# Altium project ZS-004.PrjPcb
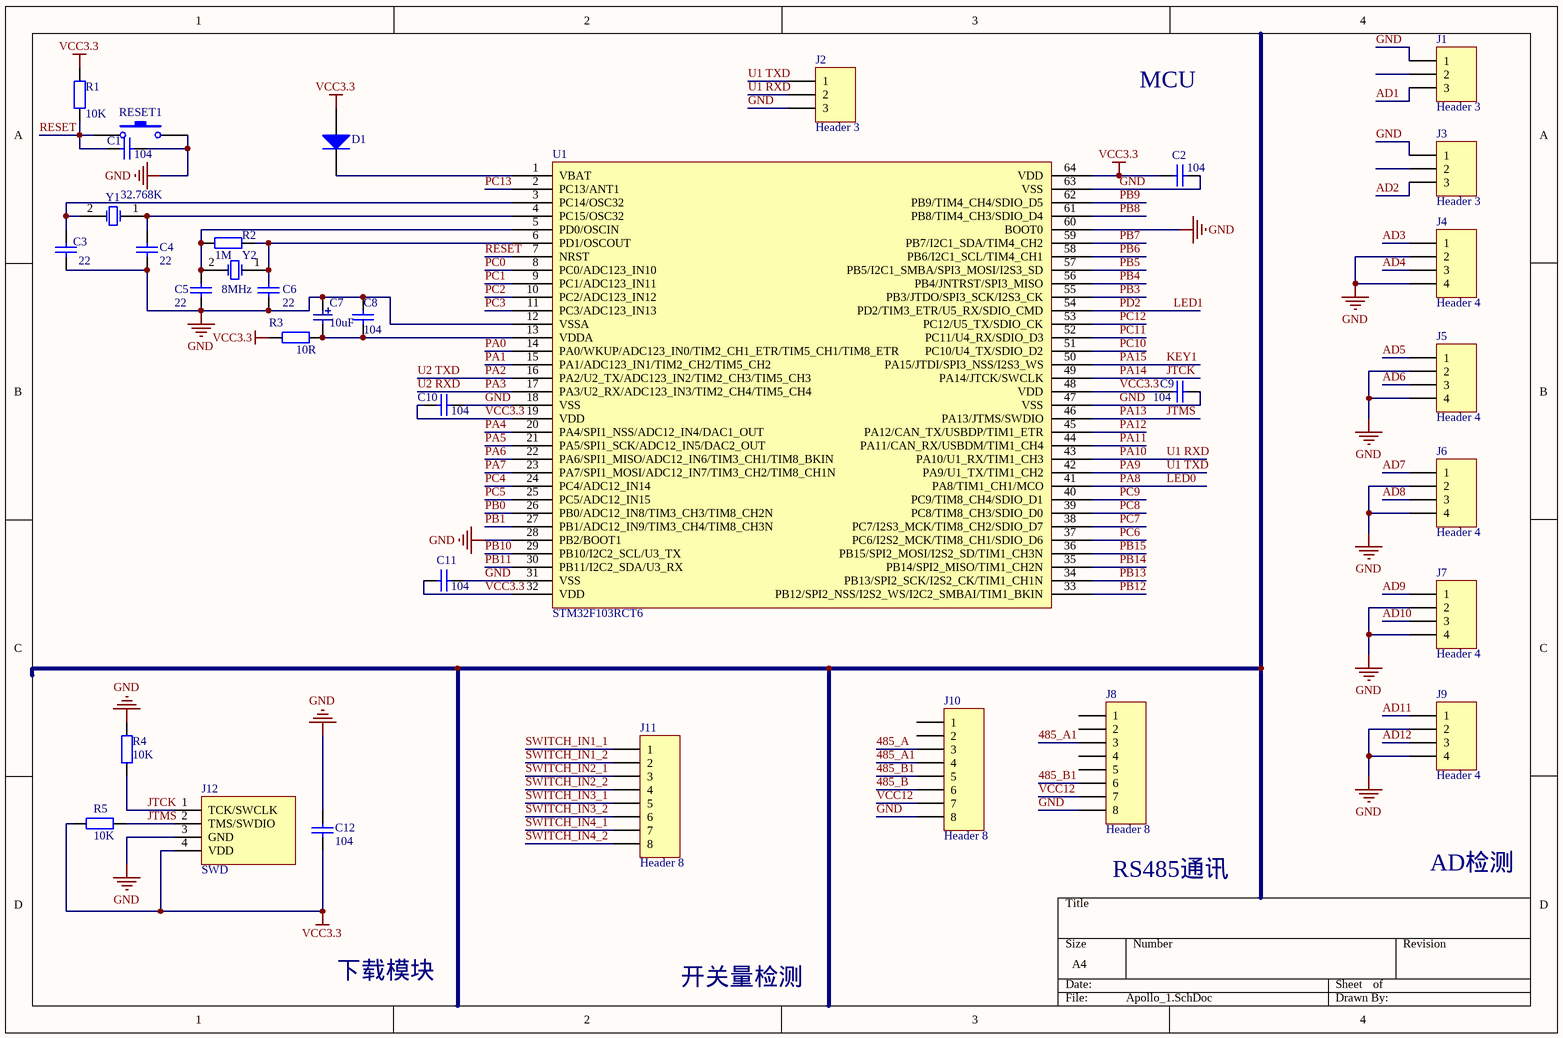
[diagram p0: Apollo_1.SchDoc]
3 sheets, 146 parts. Net scope: global (net labels, ports and power ports of the same name join across sheets).
Board file: Apollp.PcbDoc
Sheets:
  Apollo_1.SchDoc
  Apollo_2.SchDoc
  Apollo_3.SchDoc

## Sheet Apollo_1.SchDoc
size A4

### Parts
C1  value 104  [0805C]  (hidden comment: Cap)
C2  value 104  [0805C]  (hidden comment: Cap)
C3  value 22  [0805C]  (hidden comment: Cap)
C4  value 22  [0805C]  (hidden comment: Cap)
C5  value 22  [0805C]  (hidden comment: Cap)
C6  value 22  [0805C]  (hidden comment: Cap)
C7  10uF  [3216T]
C8  value 104  [0805c]  (hidden comment: Cap)
C9  value 104  [0805C]  (hidden comment: Cap)
C10  value 104  [0805C]  (hidden comment: Cap)
C11  value 104  [0805C]  (hidden comment: Cap)
C12  value 104  [0805C]  (hidden comment: Cap)
D1  Diode 1N914  [1206]  (value not drawn)
J1  Header 3  [HDR1X3]
J2  Header 3  [HDR1X3]
J3  Header 3  [HDR1X3]
J4  Header 4  [2EDG 4-3.80]
J5  Header 4  [2EDG 4-3.80]
J6  Header 4  [2EDG 4-3.80]
J7  Header 4  [2EDG 4-3.80]
J8  Header 8  [RJ45]
J9  Header 4  [2EDG 4-3.80]
J10  Header 8  [RJ45]
J11  Header 8  [2EDG 8-3.80]
J12  SWD  [SWD]
R1  value 10K  [0805]  (hidden comment: Res2)
R2  value 1M  [0805]  (hidden comment: Res2)
R3  value 10R  [0805]  (hidden comment: Res2)
R4  value 10K  [0805]  (hidden comment: Res2)
R5  value 10K  [0805]  (hidden comment: Res2)
RESET1  SW-PB  [SWITCH]  (value not drawn)
U1  STM32F103RCT6  [STM32F103RCT6]
Y1  XTAL  [tc-26]  (value not drawn)
Y2  8MHz  [Y2]

### Nets
GND: C1.2 C2.2 C3.1 C4.1 C5.1 C6.2 C7.1 C8.2 C9.2 C10.1 C11.2 C12.1 J1.1 J2.3 J3.1 J4.2 J4.4 J5.2 J5.4 J6.2 J6.4 J7.2 J7.4 J8.8 J9.2 J9.4 J10.8 J12.3(GND) R4.1 RESET1.2 U1.12(VSSA) U1.18(VSS) U1.28(PB2/BOOT1) U1.31(VSS) U1.47(VSS) U1.60(BOOT0) U1.63(VSS)
VCC3.3: C2.1 C9.1 C10.2 C11.1 C12.2 D1.1(A) J12.4(VDD) R1.2 R3.2 R5.2 U1.19(VDD) U1.32(VDD) U1.48(VDD) U1.64(VDD)
VCC12: J8.7 J10.7
32.768K: C3.2 U1.3(PC14/OSC32) Y1.2(OSC2)
485_A: J10.3
485_A1: J8.3 J10.4
485_B: J10.6
485_B1: J8.6 J10.5
AD1: J1.3
AD2: J3.3
AD3: J4.1
AD4: J4.3
AD5: J5.1
AD6: J5.3
AD7: J6.1
AD8: J6.3
AD9: J7.1
AD10: J7.3
AD11: J9.1
AD12: J9.3
JTCK: J12.1(TCK/SWCLK) R4.2 U1.49(PA14/JTCK/SWCLK)  [also labelled PA14]
JTMS: J12.2(TMS/SWDIO) R5.1 U1.46(PA13/JTMS/SWDIO)  [also labelled PA13]
KEY1: U1.50(PA15/JTDI/SPI3_NSS/I2S3_WS)  [also labelled PA15]
LED0: U1.41(PA8/TIM1_CH1/MCO)  [also labelled PA8]
LED1: U1.54(PD2/TIM3_ETR/U5_RX/SDIO_CMD)  [also labelled PD2]
PA0: U1.14(PA0/WKUP/ADC123_IN0/TIM2_CH1_ETR/TIM5_CH1/TIM8_ETR)
PA1: U1.15(PA1/ADC123_IN1/TIM2_CH2/TIM5_CH2)
PA2: U1.16(PA2/U2_TX/ADC123_IN2/TIM2_CH3/TIM5_CH3)  [also labelled U2 TXD]
PA3: U1.17(PA3/U2_RX/ADC123_IN3/TIM2_CH4/TIM5_CH4)  [also labelled U2 RXD]
PA4: U1.20(PA4/SPI1_NSS/ADC12_IN4/DAC1_OUT)
PA5: U1.21(PA5/SPI1_SCK/ADC12_IN5/DAC2_OUT)
PA6: U1.22(PA6/SPI1_MISO/ADC12_IN6/TIM3_CH1/TIM8_BKIN)
PA7: U1.23(PA7/SPI1_MOSI/ADC12_IN7/TIM3_CH2/TIM8_CH1N)
PA9: J2.1 U1.42(PA9/U1_TX/TIM1_CH2)  [also labelled U1 TXD]
PA10: J2.2 U1.43(PA10/U1_RX/TIM1_CH3)  [also labelled U1 RXD]
PA11: U1.44(PA11/CAN_RX/USBDM/TIM1_CH4)
PA12: U1.45(PA12/CAN_TX/USBDP/TIM1_ETR)
PB0: U1.26(PB0/ADC12_IN8/TIM3_CH3/TIM8_CH2N)
PB1: U1.27(PB1/ADC12_IN9/TIM3_CH4/TIM8_CH3N)
PB3: U1.55(PB3/JTDO/SPI3_SCK/I2S3_CK)
PB4: U1.56(PB4/JNTRST/SPI3_MISO)
PB5: U1.57(PB5/I2C1_SMBA/SPI3_MOSI/I2S3_SD)
PB6: U1.58(PB6/I2C1_SCL/TIM4_CH1)
PB7: U1.59(PB7/I2C1_SDA/TIM4_CH2)
PB8: U1.61(PB8/TIM4_CH3/SDIO_D4)
PB9: U1.62(PB9/TIM4_CH4/SDIO_D5)
PB10: U1.29(PB10/I2C2_SCL/U3_TX)
PB11: U1.30(PB11/I2C2_SDA/U3_RX)
PB12: U1.33(PB12/SPI2_NSS/I2S2_WS/I2C2_SMBAI/TIM1_BKIN)
PB13: U1.34(PB13/SPI2_SCK/I2S2_CK/TIM1_CH1N)
PB14: U1.35(PB14/SPI2_MISO/TIM1_CH2N)
PB15: U1.36(PB15/SPI2_MOSI/I2S2_SD/TIM1_CH3N)
PC0: U1.8(PC0/ADC123_IN10)
PC1: U1.9(PC1/ADC123_IN11)
PC2: U1.10(PC2/ADC123_IN12)
PC3: U1.11(PC3/ADC123_IN13)
PC4: U1.24(PC4/ADC12_IN14)
PC5: U1.25(PC5/ADC12_IN15)
PC6: U1.37(PC6/I2S2_MCK/TIM8_CH1/SDIO_D6)
PC7: U1.38(PC7/I2S3_MCK/TIM8_CH2/SDIO_D7)
PC8: U1.39(PC8/TIM8_CH3/SDIO_D0)
PC9: U1.40(PC9/TIM8_CH4/SDIO_D1)
PC10: U1.51(PC10/U4_TX/SDIO_D2)
PC11: U1.52(PC11/U4_RX/SDIO_D3)
PC12: U1.53(PC12/U5_TX/SDIO_CK)
PC13: U1.2(PC13/ANT1)
RESET: C1.1 R1.1 RESET1.1 U1.7(NRST)
SWITCH_IN1_1: J11.1
SWITCH_IN1_2: J11.2
SWITCH_IN2_1: J11.3
SWITCH_IN2_2: J11.4
SWITCH_IN3_1: J11.5
SWITCH_IN3_2: J11.6
SWITCH_IN4_1: J11.7
SWITCH_IN4_2: J11.8
NetC4_2: C4.2 U1.4(PC15/OSC32) Y1.1(OSC1)
NetC5_2: C5.2 R2.2 U1.5(PD0/OSCIN) Y2.2(OSC2)
NetC6_1: C6.1 R2.1 U1.6(PD1/OSCOUT) Y2.1(OSC1)
NetC7_2: C7.2 C8.1 R3.1 U1.13(VDDA)
NetD1_2: D1.2(K) U1.1(VBAT)

Not connected (* = marked no-connect by the designer): J1 2; J3 2; J8 1 2 4 5; J10 1 2

### Notes on the sheet
- Labels drawn without touching a wire or pin: AD检测, MCU, RS485通讯, 下载模块, 开关量检测

### Library data of the parts
C1-C6 C8-C12 = Cap: Capacitor; Published: 8-Jun-2000; LatestRevisionDate: 17-Jul-2002; LatestRevisionNote: Re-released for DXP Platform.; PackageReference: RAD-0.3; Publisher: Altium Limited; PackageDescription: Radial Cap, Thru-Hole; 2 Leads; 0.3 in Pin Spacing
C7 = CAP-POL1
D1 = Diode 1N914: High Conductance Fast Diode; Published: 8-Jun-2000; LatestRevisionDate: 17-Jul-2002; LatestRevisionNote: Re-released for DXP Platform.; DatasheetVersion: 1997; PackageReference: DO-35; Publisher: Altium Limited; PackageDescription: Diode, Axial; Body 3.8 x 1.9 mm (LxDia. max), Lead Dia. 0.53 mm (max); Code_JEDEC: DO-204-AH; ComponentLink1Description: Manufacturer Link; ComponentLink1URL: http://www.fairchildsemi.com/; ComponentLink2Description: Datasheet; ComponentLink2URL: http://www.fairchildsemi.com/ds/1N%2F1N4448.pdf
J1-J3 = Header 3: Header, 3-Pin; LatestRevisionDate: 17-Jul-2002; LatestRevisionNote: Re-released for DXP Platform.; Publisher: Altium Limited
J4-J7 J9 = Header 4: Header, 4-Pin; LatestRevisionDate: 17-Jul-2002; LatestRevisionNote: Re-released for DXP Platform.; Publisher: Altium Limited
J8 J10 J11 = Header 8: Header, 8-Pin; LatestRevisionDate: 17-Jul-2002; LatestRevisionNote: Re-released for DXP Platform.; Publisher: Altium Limited
R1-R5 = Res2: Resistor; Published: 8-Jun-2000; LatestRevisionDate: 17-Jul-2002; LatestRevisionNote: Re-released for DXP Platform.; PackageReference: AXIAL-0.4; Publisher: Altium Limited; PackageDescription: Axial Device, Thru-Hole; 2 Leads; 0.4 in Pin Spacing
RESET1 = SW-PB: Switch; Published: 24-Mar-1999; LatestRevisionDate: 17-Jul-2002; LatestRevisionNote: Re-released for DXP Platform.; PackageReference: SPST-2; Publisher: Altium Limited; PackageDescription: Switch; 2 Leads
Y1 Y2 = XTAL: Crystal Oscillator; Published: 8-Jun-2000; LatestRevisionDate: 17-Jul-2002; LatestRevisionNote: Re-released for DXP Platform.; PackageReference: R38; Publisher: Altium Limited; PackageDescription: Crystal, Thru-Hole; 2 Leads; Body 3.1 x 8.2 mm (Dia.xH)

## Sheet Apollo_2.SchDoc
size A4
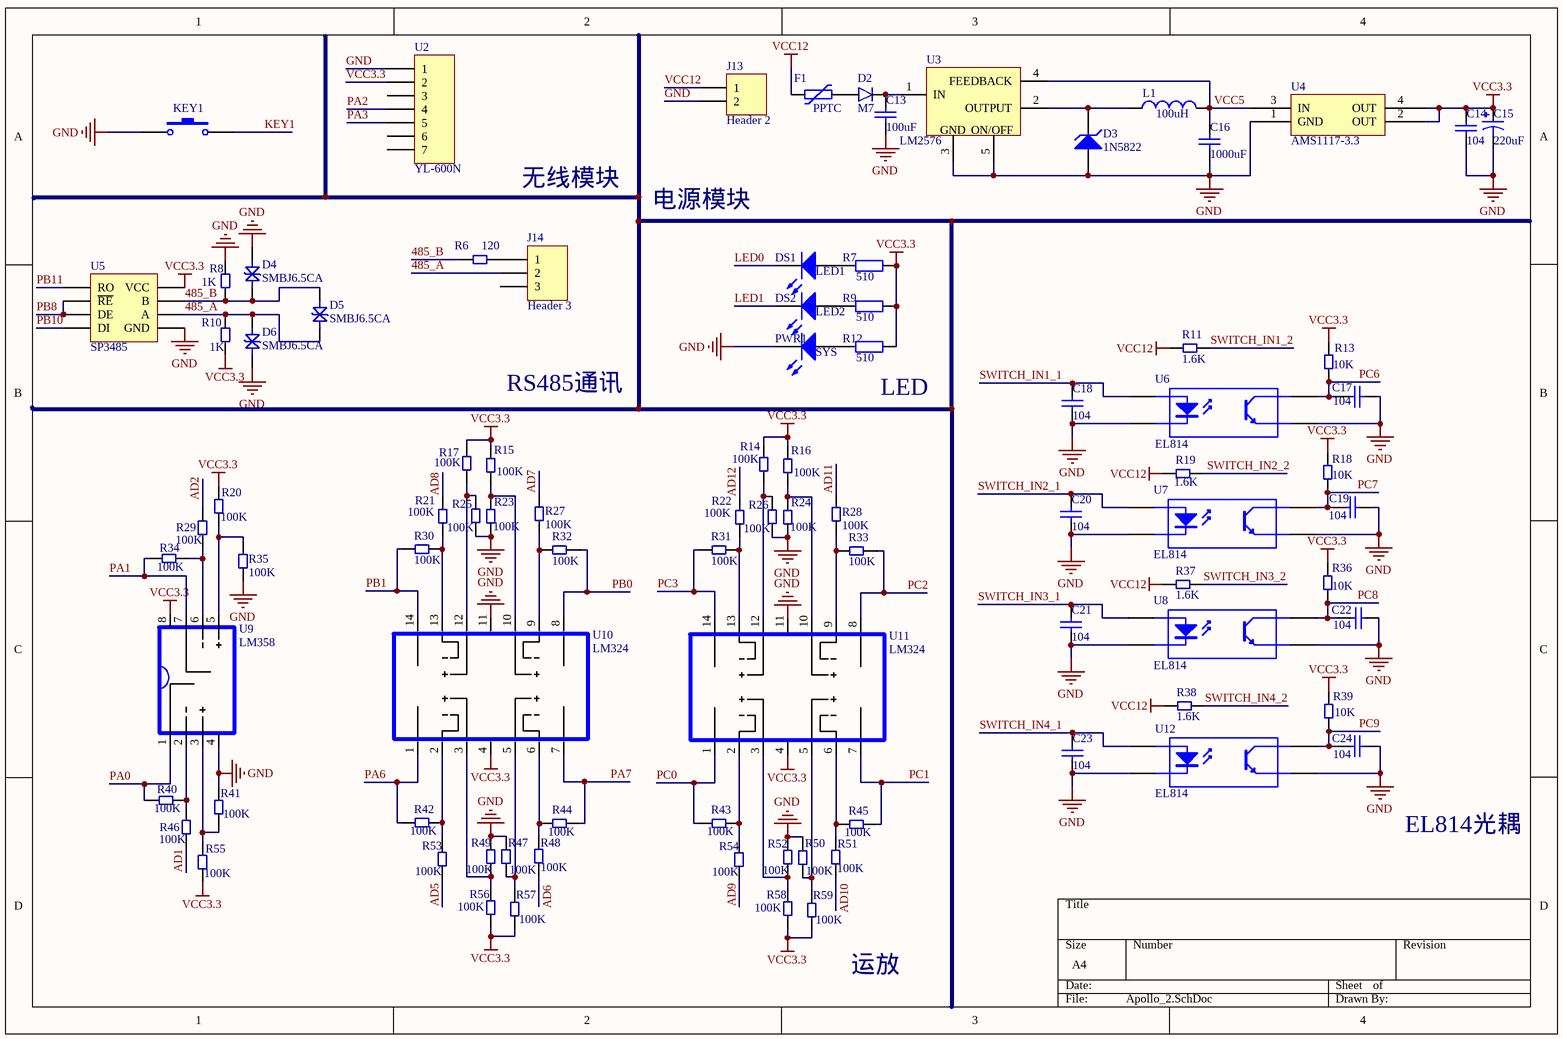
[diagram p1: Apollo_2.SchDoc]

### Parts
C13  value 100uF  [cap3.3-8 - duplicate]
C14  value 104  [0805]  (hidden comment: Cap)
C15  value 220uF  [C15]  (hidden comment: Cap Pol1)
C16  value 1000uF  [C16]
C17  value 104  [0805C]
C18  value 104  [0805C]
C19  value 104  [0805C]
C20  value 104  [0805C]
C21  value 104  [0805C]
C22  value 104  [0805C]
C23  value 104  [0805C]
C24  value 104  [0805C]
D2  M7  [SMA (DO-214AC)]
D3  1N5822  [smb do214aa]
D4  SMBJ6.5CA  [smb do214aa]
D5  SMBJ6.5CA  [smb do214aa]
D6  SMBJ6.5CA  [smb do214aa]
DS1  LED1  [0805-D]
DS2  LED2  [0805-D]
F1  PPTC  [1206]
J13  Header 2  [2EDG 2-3.80]
J14  Header 3  [HDR1X3]
KEY1  SW-PB  [SWITCH]  (value not drawn)
L1  value 100uH  [l1212]
PWR1  SYS  [0805-D]
R6  120  [0805]
R7  value 510  [0805]
R8  1K  [0805]
R9  value 510  [0805]
R10  1K  [0805]
R11  1.6K  [0805]
R12  value 510  [0805]
R13  10K  [0805]
R14  100K  [0805]
R15  100K  [0805]
R16  100K  [0805]
R17  100K  [0805]
R18  10K  [0805]
R19  1.6K  [0805]
R20  100K  [0805]
R21  100K  [0805]
R22  100K  [0805]
R23  100K  [0805]
R24  100K  [0805]
R25  100K  [0805]
R26  100K  [0805]
R27  100K  [0805]
R28  100K  [0805]
R29  100K  [0805]
R30  100K  [0805]
R31  100K  [0805]
R32  100K  [0805]
R33  100K  [0805]
R34  100K  [0805]
R35  100K  [0805]
R36  10K  [0805]
R37  1.6K  [0805]
R38  1.6K  [0805]
R39  10K  [0805]
R40  100K  [0805]
R41  100K  [0805]
R42  100K  [0805]
R43  100K  [0805]
R44  100K  [0805]
R45  100K  [0805]
R46  100K  [0805]
R47  100K  [0805]
R48  100K  [0805]
R49  100K  [0805]
R50  100K  [0805]
R51  100K  [0805]
R52  100K  [0805]
R53  100K  [0805]
R54  100K  [0805]
R55  100K  [0805]
R56  100K  [0805]
R57  100K  [0805]
R58  100K  [0805]
R59  100K  [0805]
U2  YL-600N  [HDR1X7]
U3  LM2576  [TO-263-5]
U4  AMS1117-3.3  [AMS1117-3.3]
U5  SP3485  [sop8]
U6  EL814  [SOP4]
U7  EL814  [SOP4]
U8  EL814  [SOP4]
U9  LM358  [sop8]
U10  LM324  [SOP-14]
U11  LM324  [SOP-14]
U12  EL814  [SOP4]

### Nets
GND: C13.1 C14.1 C15.2 C16.1 C17.1 C18.1 C19.1 C20.1 C21.1 C22.1 C23.1 C24.1 D3.1(A) D4.1 D6.2 J13.2 KEY1.1 PWR1.2(K) R8.2 R23.2 R24.2 R25.2 R26.2 R35.2 R41.2 R47.2 R49.2 R50.2 R52.2 U2.1 U3.3 U3.5 U4.1(GND) U5.5(GND) U6.2(K) U6.3(E) U7.2(K) U7.3(E) U8.2(K) U8.3(E) U9.4 U10.11 U11.11 U12.2(K) U12.3(E)
VCC3.3: C14.2 C15.1 R7.2 R9.2 R10.1 R12.2 R13.1 R14.1 R15.1 R16.1 R17.1 R18.1 R20.2 R36.1 R39.1 R55.1 R56.1 R57.1 R58.1 R59.1 U2.2 U4.2(OUT) U4.4(OUT) U5.8(VCC) U9.8 U10.4 U11.4
VCC12: F1.1 J13.1 R11.1 R19.1 R37.1 R38.1
485_A: D5.2 D6.1 J14.2 R10.2 U5.6(A)
485_B: D4.2 D5.1 R6.2 R8.1 U5.7(B)
AD1: R46.1
AD2: R29.2
AD5: R53.1
AD6: R48.1
AD7: R27.1
AD8: R21.1
AD9: R54.1
AD10: R51.1
AD11: R28.1
AD12: R22.1
KEY1: KEY1.2
LED0: DS1.2(K)
LED1: DS2.2(K)
PA0: R40.2 U9.1
PA1: R34.2 U9.7
PA2: U2.4
PA3: U2.5
PA6: R42.2 U10.1
PA7: R44.1 U10.7
PB0: R32.2 U10.8
PB1: R30.1 U10.14
PB8: U5.2(~{RE}) U5.3(DE)
PB10: U5.4(DI)
PB11: U5.1(RO)
PC0: R43.2 U11.1
PC1: R45.1 U11.7
PC2: R33.2 U11.8
PC3: R31.1 U11.14
PC6: C17.2 R13.2 U6.4(C)
PC7: C19.2 R18.2 U7.4(C)
PC8: C22.2 R36.2 U8.4(C)
PC9: C24.2 R39.2 U12.4(C)
SWITCH_IN1_1: C18.2 U6.1(A)
SWITCH_IN1_2: R11.2
SWITCH_IN2_1: C20.2 U7.1(A)
SWITCH_IN2_2: R19.2
SWITCH_IN3_1: C21.2 U8.1(A)
SWITCH_IN3_2: R37.2
SWITCH_IN4_1: C23.2 U12.1(A)
SWITCH_IN4_2: R38.2
VCC5: C16.2 L1.2 U3.4(FEEDBACK) U4.3(IN)
NetC13_2: C13.2 D2.1(-) U3.1(IN)
NetD2_2: D2.2(+) F1.2
NetD3_2: D3.2(K) L1.1 U3.2(OUTPUT)
NetDS1_1: DS1.1(A) R7.1
NetDS2_1: DS2.1(A) R9.1
NetJ14_1: J14.1 R6.1
NetPWR1_1: PWR1.1(A) R12.1
NetR14_2: R14.2 R26.1 U11.12
NetR15_2: R15.2 R23.1 U10.10
NetR16_2: R16.2 R24.1 U11.10
NetR17_2: R17.2 R25.1 U10.12
NetR20_1: R20.1 R35.1 U9.5
NetR21_2: R21.2 R30.2 U10.13
NetR22_2: R22.2 R31.2 U11.13
NetR27_2: R27.2 R32.1 U10.9
NetR28_2: R28.2 R33.1 U11.9
NetR29_1: R29.1 R34.1 U9.6
NetR40_1: R40.1 R46.2 U9.2
NetR41_1: R41.1 R55.2 U9.3
NetR42_1: R42.1 R53.2 U10.2
NetR43_1: R43.1 R54.2 U11.2
NetR44_2: R44.2 R48.2 U10.6
NetR45_2: R45.2 R51.2 U11.6
NetR47_1: R47.1 R57.2 U10.5
NetR49_1: R49.1 R56.2 U10.3
NetR50_1: R50.1 R59.2 U11.5
NetR52_1: R52.1 R58.2 U11.3

Not connected (* = marked no-connect by the designer): J14 3; U2 3 6 7

### Notes on the sheet
- (near U3) GND
- (near U3) ON/OFF
- Labels drawn without touching a wire or pin: EL814光耦, LED, RS485通讯, 无线模块, 电源模块, 运放

### Library data of the parts
C13 C14 C16-C24 = Cap: Capacitor; Published: 8-Jun-2000; LatestRevisionDate: 17-Jul-2002; LatestRevisionNote: Re-released for DXP Platform.; PackageReference: RAD-0.3; Publisher: Altium Limited; PackageDescription: Radial Cap, Thru-Hole; 2 Leads; 0.3 in Pin Spacing
C15 = Cap Pol1: Polarized Capacitor (Radial); Published: 8-Jun-2000; LatestRevisionDate: 17-Jul-2002; LatestRevisionNote: Re-released for DXP Platform.; PackageReference: RB7.6-15; Publisher: Altium Limited; PackageDescription: Polarized Capacitor (Radial); 2 Leads
D3 = D Zener: Zener Diode; Published: 8-Jun-2000; LatestRevisionDate: 17-Jul-2002; LatestRevisionNote: Re-released for DXP Platform.; PackageReference: DIODE-0.7; Publisher: Altium Limited; PackageDescription: Diode, Thru-Hole; 2 Leads; 0.7 in Pin Spacing
DS1 DS2 PWR1 = LED0: Typical INFRARED GaAs LED; Published: 8-Jun-2000; LatestRevisionDate: 08-Jul-2005; LatestRevisionNote: Mech Layer 1 removed.; PackageReference: LED-0; Publisher: Altium Limited; PackageDescription: LED; 2 Leads
J13 = Header 2: Header, 2-Pin; LatestRevisionDate: 17-Jul-2002; LatestRevisionNote: Re-released for DXP Platform.; Publisher: Altium Limited
J14 = Header 3: Header, 3-Pin; LatestRevisionDate: 17-Jul-2002; LatestRevisionNote: Re-released for DXP Platform.; Publisher: Altium Limited
KEY1 = SW-PB: Switch; Published: 24-Mar-1999; LatestRevisionDate: 17-Jul-2002; LatestRevisionNote: Re-released for DXP Platform.; PackageReference: SPST-2; Publisher: Altium Limited; PackageDescription: Switch; 2 Leads
L1 = Inductor: Code_IEC: 1005; Published: 8-Jun-2000; LatestRevisionDate: 29-May-2009; LatestRevisionNote: IPC-7351 Footprint Added.; PackageReference: 0402-A; Publisher: Altium Limited; PackageDescription: Chip Inductor; Code_JEITA: 0402
R6 R8 R10 R11 R13-R59 = Res
R7 R9 R12 = Res2: Resistor; Published: 8-Jun-2000; LatestRevisionDate: 17-Jul-2002; LatestRevisionNote: Re-released for DXP Platform.; PackageReference: AXIAL-0.4; Publisher: Altium Limited; PackageDescription: Axial Device, Thru-Hole; 2 Leads; 0.4 in Pin Spacing
U2 = Header 7: Header, 7-Pin; LatestRevisionDate: 17-Jul-2002; LatestRevisionNote: Re-released for DXP Platform.; Publisher: Altium Limited
U6-U8 U12 = TLP281
U10 U11 = LM324N

## Sheet Apollo_3.SchDoc
size A4
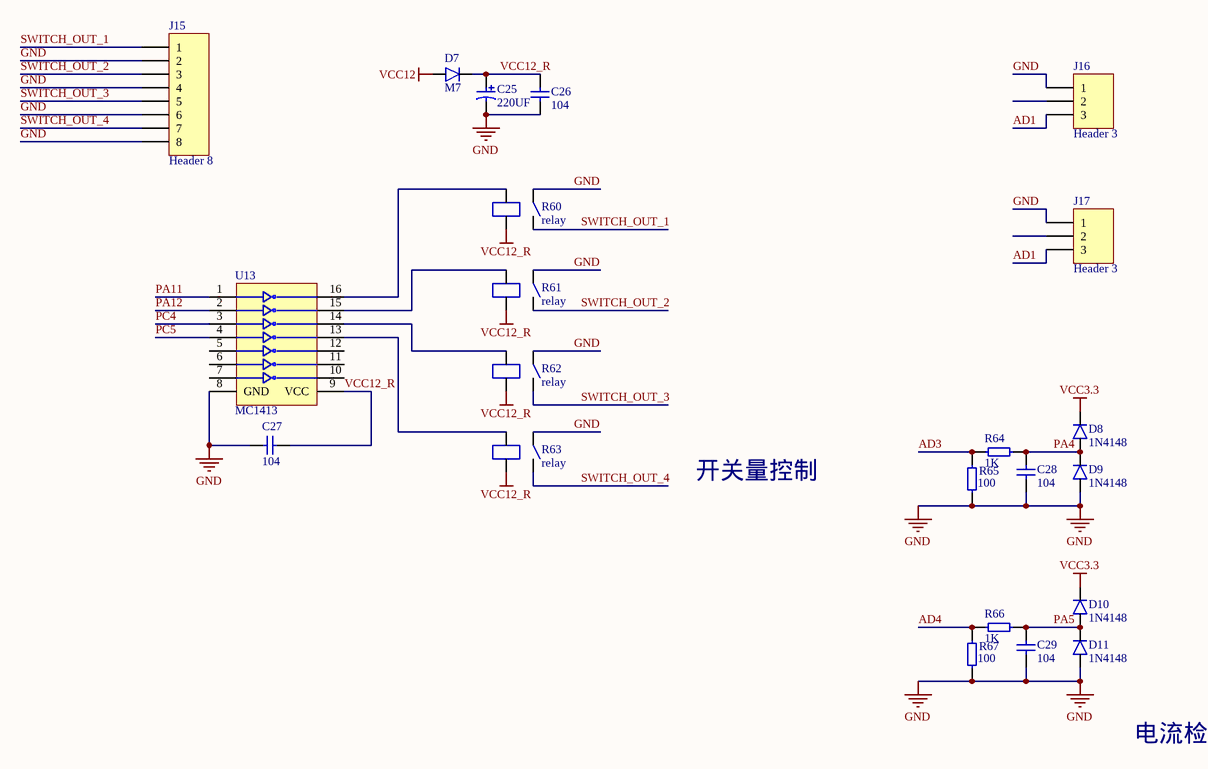
[diagram p2: Apollo_3.SchDoc]

### Parts
C25  220UF  [RB 2.5/6.3]
C26  104  [0805C]
C27  104  [0805C]
C28  104  [0805C]
C29  104  [0805C]
D7  M7  [SMA (DO-214AC)]
D8  1N4148  [SOD 323]
D9  1N4148  [SOD 323]
D10  1N4148  [SOD 323]
D11  1N4148  [SOD 323]
J15  Header 8  [2EDG 8-3.80]
J16  Header 3  [3EDG 3-5.08]
J17  Header 3  [3EDG 3-3.80]
R60  relay  [HF49FD/012-1H11]
R61  relay  [HF49FD/012-1H11]
R62  relay  [HF49FD/012-1H11]
R63  relay  [HF49FD/012-1H11]
R64  1K  [0805]
R65  100  [0805]
R66  1K  [0805]
R67  100  [0805]
U13  MC1413  [SOP 16-1.27/3.9]

### Nets
GND: C25.1 C26.1 C27.1 C28.1 C29.1 D9.2(+) D11.2(+) J15.2 J15.4 J15.6 J15.8 J16.1 J17.1 R60.3 R61.3 R62.3 R63.3 R65.1 R67.1 U13.8(GND)
VCC3.3: D8.1(-) D10.1(-)
VCC12: D7.2(+)
VCC12_R: C25.2 C26.2 C27.2 D7.1(-) R60.2 R61.2 R62.2 R63.2 U13.9(VCC)
AD1: J16.3 J17.3
AD3: R64.2 R65.2
AD4: R66.2 R67.2
PA4: C28.2 D8.2(+) D9.1(-) R64.1
PA5: C29.2 D10.2(+) D11.1(-) R66.1
PA11: U13.1
PA12: U13.2
PC4: U13.3
PC5: U13.4
SWITCH_OUT_1: J15.1 R60.4
SWITCH_OUT_2: J15.3 R61.4
SWITCH_OUT_3: J15.5 R62.4
SWITCH_OUT_4: J15.7 R63.4
NetR60_1: R60.1 U13.16
NetR61_1: R61.1 U13.15
NetR62_1: R62.1 U13.14
NetR63_1: R63.1 U13.13

Not connected (* = marked no-connect by the designer): J16 2; J17 2; U13 5 6 7 10 11 12

### Notes on the sheet
- Labels drawn without touching a wire or pin: 开关量控制, 电流检测

### Library data of the parts
C25 = CAP-POL2
C26-C29 = CAP
J15 = Header 8: Header, 8-Pin; LatestRevisionDate: 17-Jul-2002; LatestRevisionNote: Re-released for DXP Platform.; Publisher: Altium Limited
J16 J17 = Header 3: Header, 3-Pin; LatestRevisionDate: 17-Jul-2002; LatestRevisionNote: Re-released for DXP Platform.; Publisher: Altium Limited
R64-R67 = RES

## Nets that join several sheets
GND: Apollo_1 (37 pins), Apollo_2 (45 pins), Apollo_3 (20 pins)
VCC3.3: Apollo_1 (14 pins), Apollo_2 (27 pins), Apollo_3 (D8.1 D10.1)
VCC12: Apollo_1 (J8.7 J10.7), Apollo_2 (6 pins), Apollo_3 (D7.2)
485_A: Apollo_1 (J10.3), Apollo_2 (5 pins)
485_B: Apollo_1 (J10.6), Apollo_2 (5 pins)
AD1: Apollo_1 (J1.3), Apollo_2 (R46.1), Apollo_3 (J16.3 J17.3)
AD2: Apollo_1 (J3.3), Apollo_2 (R29.2)
AD3: Apollo_1 (J4.1), Apollo_3 (R64.2 R65.2)
AD4: Apollo_1 (J4.3), Apollo_3 (R66.2 R67.2)
AD5: Apollo_1 (J5.1), Apollo_2 (R53.1)
AD6: Apollo_1 (J5.3), Apollo_2 (R48.1)
AD7: Apollo_1 (J6.1), Apollo_2 (R27.1)
AD8: Apollo_1 (J6.3), Apollo_2 (R21.1)
AD9: Apollo_1 (J7.1), Apollo_2 (R54.1)
AD10: Apollo_1 (J7.3), Apollo_2 (R51.1)
AD11: Apollo_1 (J9.1), Apollo_2 (R28.1)
AD12: Apollo_1 (J9.3), Apollo_2 (R22.1)
KEY1: Apollo_1 (U1.50), Apollo_2 (KEY1.2)
LED0: Apollo_1 (U1.41), Apollo_2 (DS1.2)
LED1: Apollo_1 (U1.54), Apollo_2 (DS2.2)
PA0: Apollo_1 (U1.14), Apollo_2 (R40.2 U9.1)
PA1: Apollo_1 (U1.15), Apollo_2 (R34.2 U9.7)
PA2: Apollo_1 (U1.16), Apollo_2 (U2.4)
PA3: Apollo_1 (U1.17), Apollo_2 (U2.5)
PA4: Apollo_1 (U1.20), Apollo_3 (C28.2 D8.2 D9.1 R64.1)
PA5: Apollo_1 (U1.21), Apollo_3 (C29.2 D10.2 D11.1 R66.1)
PA6: Apollo_1 (U1.22), Apollo_2 (R42.2 U10.1)
PA7: Apollo_1 (U1.23), Apollo_2 (R44.1 U10.7)
PA11: Apollo_1 (U1.44), Apollo_3 (U13.1)
PA12: Apollo_1 (U1.45), Apollo_3 (U13.2)
PB0: Apollo_1 (U1.26), Apollo_2 (R32.2 U10.8)
PB1: Apollo_1 (U1.27), Apollo_2 (R30.1 U10.14)
PB8: Apollo_1 (U1.61), Apollo_2 (U5.2 U5.3)
PB10: Apollo_1 (U1.29), Apollo_2 (U5.4)
PB11: Apollo_1 (U1.30), Apollo_2 (U5.1)
PC0: Apollo_1 (U1.8), Apollo_2 (R43.2 U11.1)
PC1: Apollo_1 (U1.9), Apollo_2 (R45.1 U11.7)
PC2: Apollo_1 (U1.10), Apollo_2 (R33.2 U11.8)
PC3: Apollo_1 (U1.11), Apollo_2 (R31.1 U11.14)
PC4: Apollo_1 (U1.24), Apollo_3 (U13.3)
PC5: Apollo_1 (U1.25), Apollo_3 (U13.4)
PC6: Apollo_1 (U1.37), Apollo_2 (C17.2 R13.2 U6.4)
PC7: Apollo_1 (U1.38), Apollo_2 (C19.2 R18.2 U7.4)
PC8: Apollo_1 (U1.39), Apollo_2 (C22.2 R36.2 U8.4)
PC9: Apollo_1 (U1.40), Apollo_2 (C24.2 R39.2 U12.4)
SWITCH_IN1_1: Apollo_1 (J11.1), Apollo_2 (C18.2 U6.1)
SWITCH_IN1_2: Apollo_1 (J11.2), Apollo_2 (R11.2)
SWITCH_IN2_1: Apollo_1 (J11.3), Apollo_2 (C20.2 U7.1)
SWITCH_IN2_2: Apollo_1 (J11.4), Apollo_2 (R19.2)
SWITCH_IN3_1: Apollo_1 (J11.5), Apollo_2 (C21.2 U8.1)
SWITCH_IN3_2: Apollo_1 (J11.6), Apollo_2 (R37.2)
SWITCH_IN4_1: Apollo_1 (J11.7), Apollo_2 (C23.2 U12.1)
SWITCH_IN4_2: Apollo_1 (J11.8), Apollo_2 (R38.2)